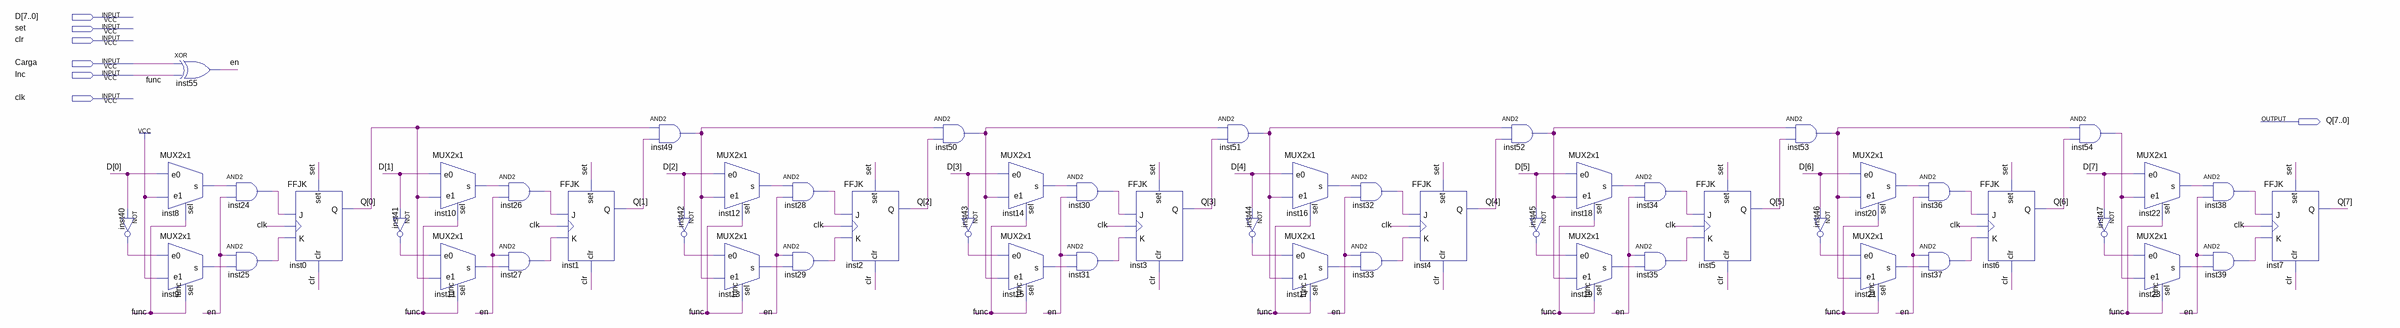
[diagram p0: schematic sheet]
// Quartus schematic PC.bdf as structural Verilog: 55 symbols, 7 pins
module PC (
  input  [7:0] D,
  input  set,
  input  clr,
  input  Carga,
  input  Inc,
  input  clk,
  output [7:0] Q
);

  wire en, inst8_s, inst9_s, inst10_s, inst11_s, inst12_s, inst13_s, inst14_s, inst15_s, inst16_s, inst17_s,
       inst18_s, inst19_s, inst20_s, inst21_s, inst22_s, inst23_s, inst24_out, inst25_out, inst26_out,
       inst27_out, inst28_out, inst29_out, inst30_out, inst31_out, inst32_out, inst33_out, inst34_out,
       inst35_out, inst36_out, inst37_out, inst38_out, inst39_out, inst40_out, inst41_out, inst42_out,
       inst43_out, inst44_out, inst45_out, inst46_out, inst47_out, inst49_out, inst50_out, inst51_out,
       inst52_out, inst53_out, inst54_out;

  not inst40 (inst40_out, D[0]);
  MUX2x1 inst8 (.e0(D[0]), .e1(1'b1), .sel(Inc), .s(inst8_s));
  MUX2x1 inst9 (.e0(inst40_out), .e1(1'b1), .sel(Inc), .s(inst9_s));
  xor inst55 (en, Carga, Inc);
  and inst24 (inst24_out, inst8_s, en);
  and inst25 (inst25_out, en, inst9_s);
  FFJK inst0 (.set(set), .J(inst24_out), .K(inst25_out), .clr(clr), .clk(clk), .Q(Q[0]));
  not inst41 (inst41_out, D[1]);
  MUX2x1 inst10 (.e0(D[1]), .e1(Q[0]), .sel(Inc), .s(inst10_s));
  MUX2x1 inst11 (.e0(inst41_out), .e1(Q[0]), .sel(Inc), .s(inst11_s));
  and inst26 (inst26_out, inst10_s, en);
  and inst27 (inst27_out, en, inst11_s);
  FFJK inst1 (.set(set), .J(inst26_out), .K(inst27_out), .clr(clr), .clk(clk), .Q(Q[1]));
  and inst49 (inst49_out, Q[0], Q[1]);
  not inst42 (inst42_out, D[2]);
  MUX2x1 inst12 (.e0(D[2]), .e1(inst49_out), .sel(Inc), .s(inst12_s));
  MUX2x1 inst13 (.e0(inst42_out), .e1(inst49_out), .sel(Inc), .s(inst13_s));
  and inst28 (inst28_out, inst12_s, en);
  and inst29 (inst29_out, en, inst13_s);
  FFJK inst2 (.set(set), .J(inst28_out), .K(inst29_out), .clr(clr), .clk(clk), .Q(Q[2]));
  and inst50 (inst50_out, inst49_out, Q[2]);
  not inst43 (inst43_out, D[3]);
  MUX2x1 inst14 (.e0(D[3]), .e1(inst50_out), .sel(Inc), .s(inst14_s));
  MUX2x1 inst15 (.e0(inst43_out), .e1(inst50_out), .sel(Inc), .s(inst15_s));
  and inst30 (inst30_out, inst14_s, en);
  and inst31 (inst31_out, en, inst15_s);
  FFJK inst3 (.set(set), .J(inst30_out), .K(inst31_out), .clr(clr), .clk(clk), .Q(Q[3]));
  and inst51 (inst51_out, inst50_out, Q[3]);
  MUX2x1 inst16 (.e0(D[4]), .e1(inst51_out), .sel(Inc), .s(inst16_s));
  not inst44 (inst44_out, D[4]);
  MUX2x1 inst17 (.e0(inst44_out), .e1(inst51_out), .sel(Inc), .s(inst17_s));
  and inst32 (inst32_out, inst16_s, en);
  and inst33 (inst33_out, en, inst17_s);
  FFJK inst4 (.set(set), .J(inst32_out), .K(inst33_out), .clr(clr), .clk(clk), .Q(Q[4]));
  and inst52 (inst52_out, inst51_out, Q[4]);
  not inst45 (inst45_out, D[5]);
  MUX2x1 inst18 (.e0(D[5]), .e1(inst52_out), .sel(Inc), .s(inst18_s));
  MUX2x1 inst19 (.e0(inst45_out), .e1(inst52_out), .sel(Inc), .s(inst19_s));
  and inst34 (inst34_out, inst18_s, en);
  and inst35 (inst35_out, en, inst19_s);
  FFJK inst5 (.set(set), .J(inst34_out), .K(inst35_out), .clr(clr), .clk(clk), .Q(Q[5]));
  and inst53 (inst53_out, inst52_out, Q[5]);
  not inst46 (inst46_out, D[6]);
  MUX2x1 inst20 (.e0(D[6]), .e1(inst53_out), .sel(Inc), .s(inst20_s));
  MUX2x1 inst21 (.e0(inst46_out), .e1(inst53_out), .sel(Inc), .s(inst21_s));
  and inst36 (inst36_out, inst20_s, en);
  and inst37 (inst37_out, en, inst21_s);
  FFJK inst6 (.set(set), .J(inst36_out), .K(inst37_out), .clr(clr), .clk(clk), .Q(Q[6]));
  and inst54 (inst54_out, inst53_out, Q[6]);
  not inst47 (inst47_out, D[7]);
  MUX2x1 inst22 (.e0(D[7]), .e1(inst54_out), .sel(Inc), .s(inst22_s));
  MUX2x1 inst23 (.e0(inst47_out), .e1(inst54_out), .sel(Inc), .s(inst23_s));
  and inst38 (inst38_out, inst22_s, en);
  and inst39 (inst39_out, en, inst23_s);
  FFJK inst7 (.set(set), .J(inst38_out), .K(inst39_out), .clr(clr), .clk(clk), .Q(Q[7]));

  // Other names for the same wires on the sheet: func = Inc
endmodule
